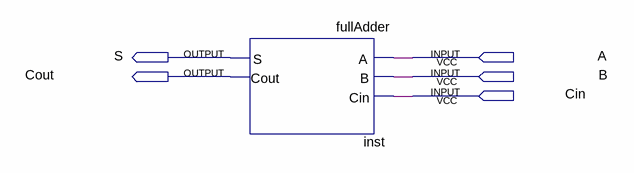
[diagram p0: schematic sheet]
// Quartus schematic adderSubtractor.bdf as structural Verilog: 1 symbols, 5 pins
module adderSubtractor (
  input  A,
  input  B,
  input  Cin,
  output S,
  output Cout
);

  fullAdder inst (.A(A), .B(B), .Cin(Cin), .S(S), .Cout(Cout));
endmodule
